# Altium schematic sheet Input_0.SchDoc
size A4
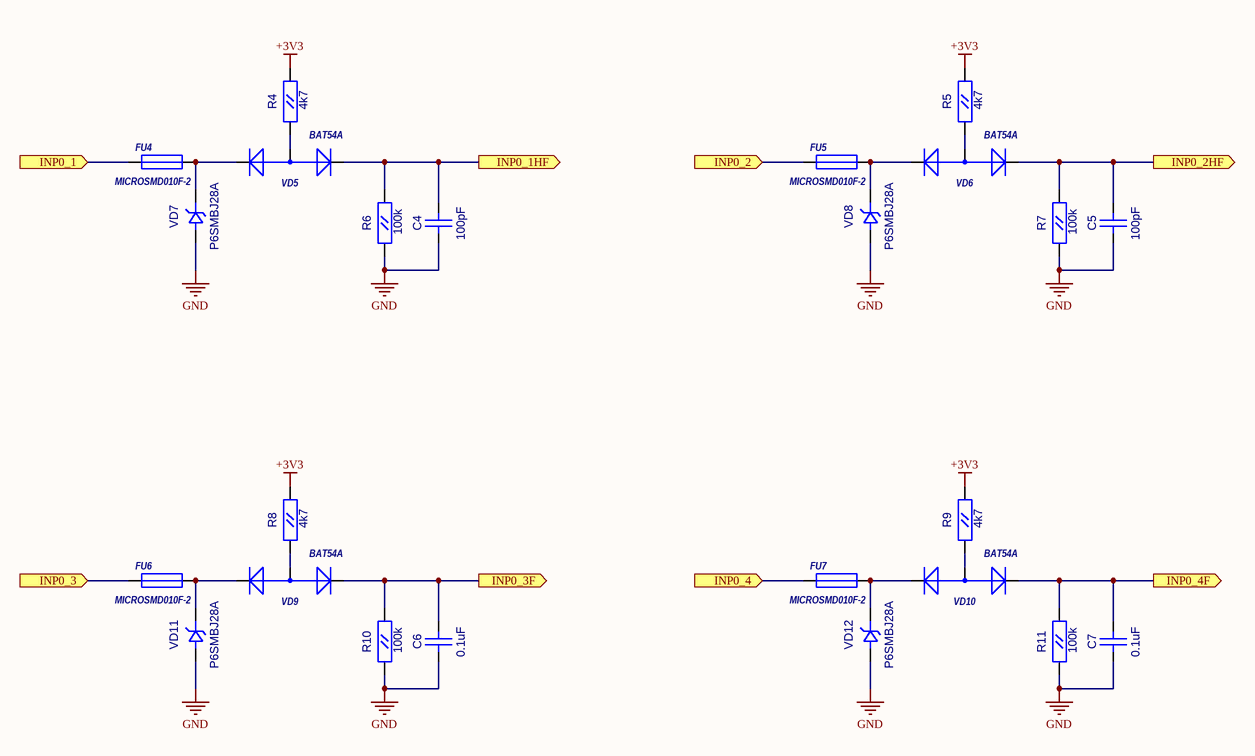
[diagram p0: Input_0.SchDoc]

## Parts
C4  100pF  [CC0603]
C5  100pF  [CC0603]
C6  0.1uF  [CC0603]
C7  0.1uF  [CC0603]
FU4  MICROSMD010F-2  [RC1210]
FU5  MICROSMD010F-2  [RC1210]
FU6  MICROSMD010F-2  [RC1210]
FU7  MICROSMD010F-2  [RC1210]
R4  4k7  [RC0603]
R5  4k7  [RC0603]
R6  100k  [RC0603]
R7  100k  [RC0603]
R8  4k7  [RC0603]
R9  4k7  [RC0603]
R10  100k  [RC0603]
R11  100k  [RC0603]
VD5  BAT54A  [SOT-23(123)]
VD6  BAT54A  [SOT-23(123)]
VD7  P6SMBJ28A  [SMB]
VD8  P6SMBJ28A  [SMB]
VD9  BAT54A  [SOT-23(123)]
VD10  BAT54A  [SOT-23(123)]
VD11  P6SMBJ28A  [SMB]
VD12  P6SMBJ28A  [SMB]

## Ports
INP0_1 (in), INP0_1HF (out), INP0_2 (in), INP0_2HF (out), INP0_3 (in), INP0_3F (out), INP0_4 (in), INP0_4F (out)

## Nets
+3V3: R4.2(B) R5.2(B) R8.2(B) R9.2(B)
GND: C4.1(A) C5.1(A) C6.1(A) C7.1(A) R6.1(A) R7.1(A) R10.1(A) R11.1(A) VD7.1(A) VD8.1(A) VD11.1(A) VD12.1(A)
INP0_1: FU4.1 ; port INP0_1
INP0_1HF: C4.2(B) R6.2(B) VD5.1(K) ; port INP0_1HF
INP0_2: FU5.1 ; port INP0_2
INP0_2HF: C5.2(B) R7.2(B) VD6.1(K) ; port INP0_2HF
INP0_3: FU6.1 ; port INP0_3
INP0_3F: C6.2(B) R10.2(B) VD9.1(K) ; port INP0_3F
INP0_4: FU7.1 ; port INP0_4
INP0_4F: C7.2(B) R11.2(B) VD10.1(K) ; port INP0_4F
NetFU4_2: FU4.2 VD5.2(K) VD7.2(K)
NetFU5_2: FU5.2 VD6.2(K) VD8.2(K)
NetFU6_2: FU6.2 VD9.2(K) VD11.2(K)
NetFU7_2: FU7.2 VD10.2(K) VD12.2(K)
NetR4_1: R4.1(A) VD5.3(A)
NetR5_1: R5.1(A) VD6.3(A)
NetR8_1: R8.1(A) VD9.3(A)
NetR9_1: R9.1(A) VD10.3(A)

## Library data of the parts
C4-C7 = CC0603
  C4 C5: Value: 100pF
  C6 C7: Value: 0.1uF
FU4-FU7 = MICROSMD: Value: MICROSMD010F-2
R4-R11 = RC0603
  R4 R5 R8 R9: Value: 4k7
  R6 R7 R10 R11: Value: 100k
VD5 VD6 VD9 VD10 = BAT54A: 1.0 Ampere General Purpose Rectifier; ComponentField6: Published 8-Jun-2000, Modified 11-July-2000: SIM Model Added.; Value: *
VD7 VD8 VD11 VD12 = SMBJ: Value: P6SMBJ28A